# EAGLE design pendant_controller (EAGLE 9.2.2)
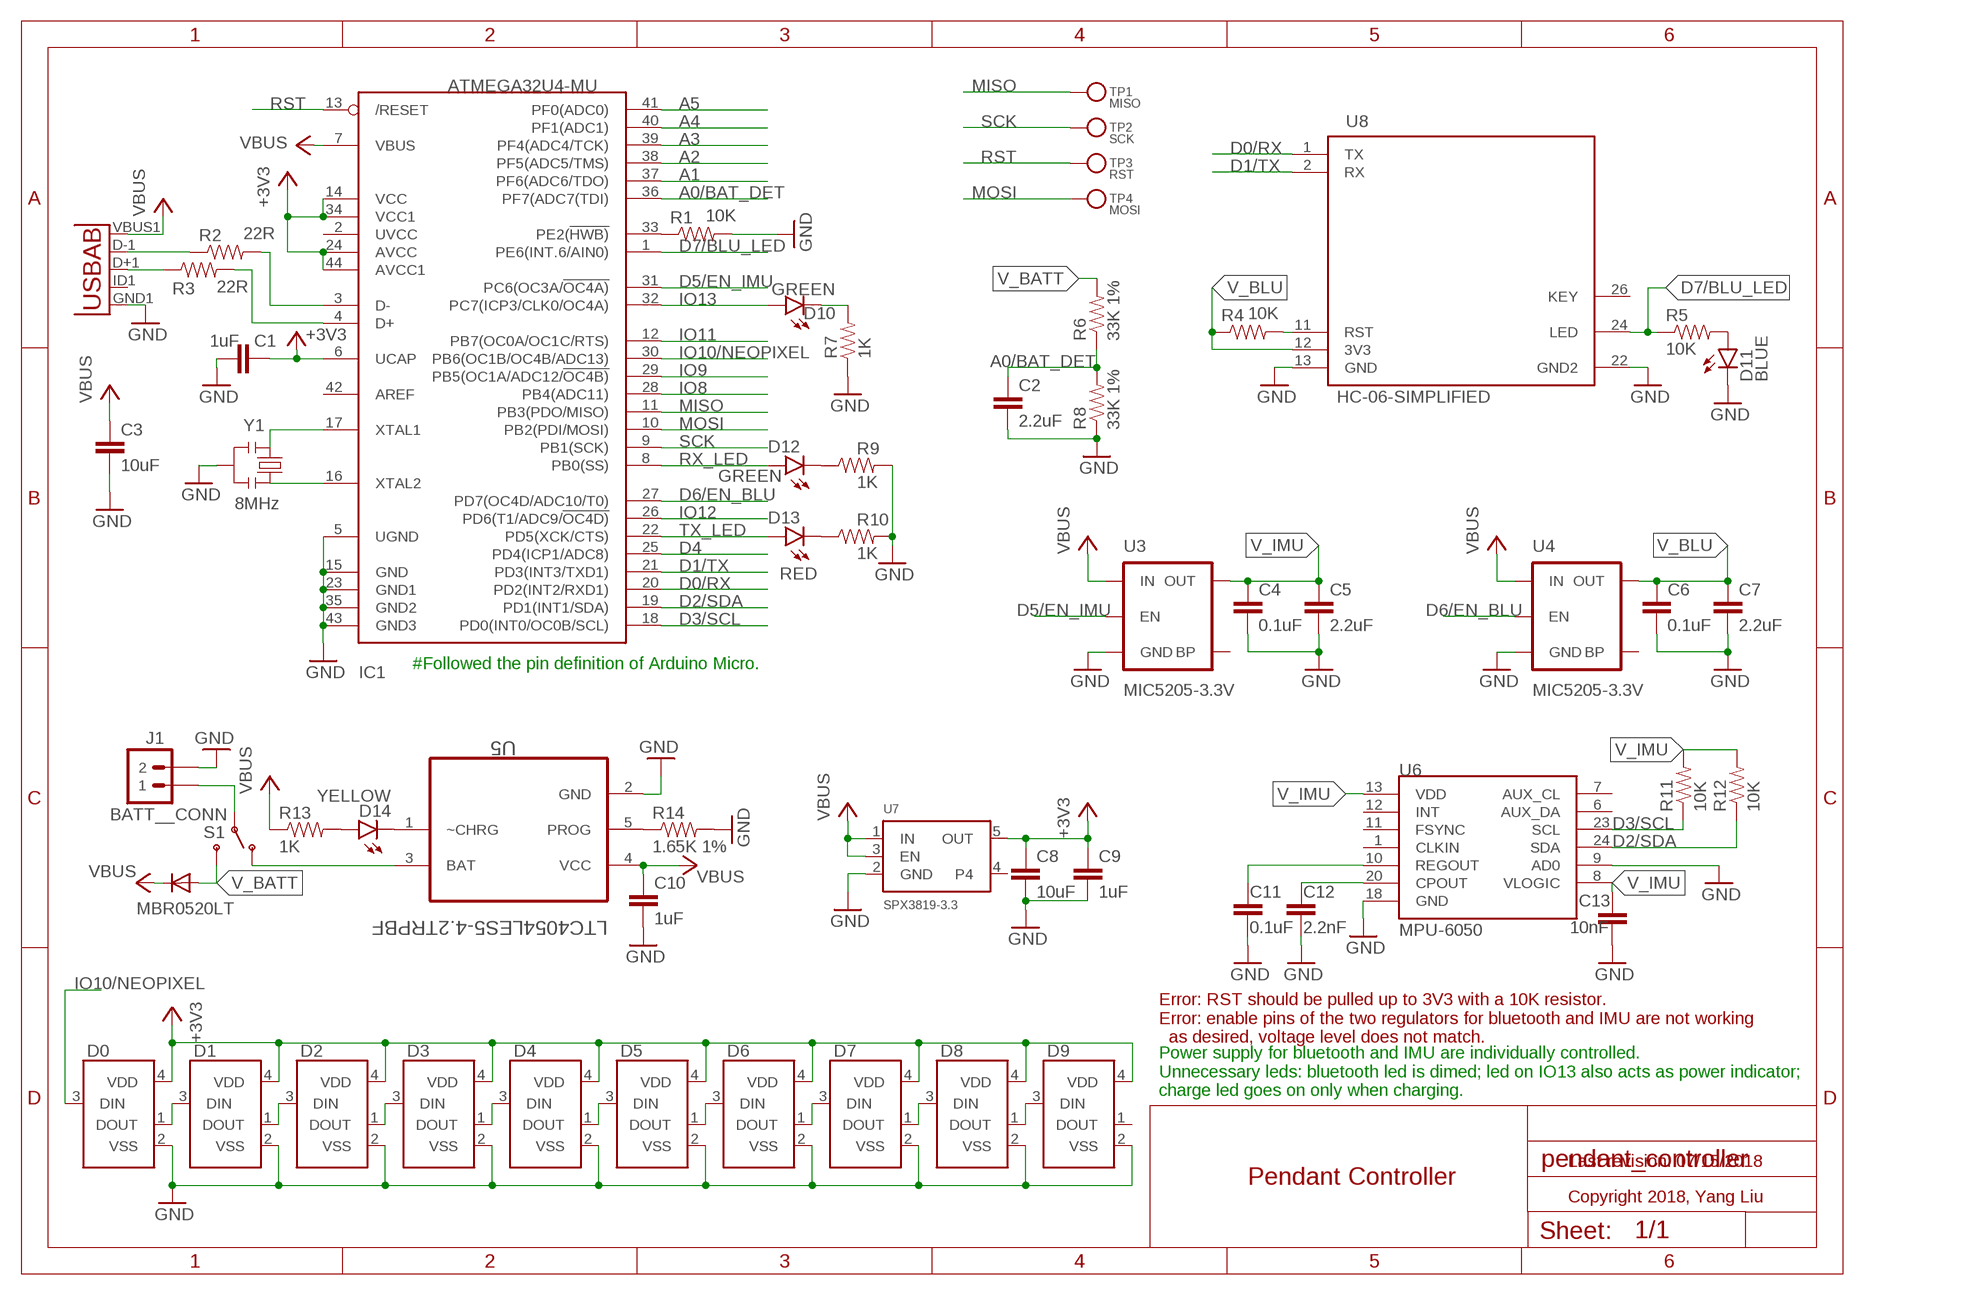
[diagram p0: schematic, sheet 1]

## Parts
C1  1uF  CAP0603-CAP  [0603-CAP]
C2  2.2uF  CAP0402-CAP  [0402-CAP]
C3  10uF  CAP1206  [1206]
C4  0.1uF  CAP0402-CAP  [0402-CAP]
C5  2.2uF  CAP0402-CAP  [0402-CAP]
C6  0.1uF  CAP0402-CAP  [0402-CAP]
C7  2.2uF  CAP0402-CAP  [0402-CAP]
C8  10uF  CAP1206  [1206]
C9  1uF  CAP0603-CAP  [0603-CAP]
C10  1uF  CAP0603-CAP  [0603-CAP]
C11  0.1uF  CAP0402-CAP  [0402-CAP]
C12  2.2nF  CAP0402-CAP  [0402-CAP]
C13  10nF  CAP0402-CAP  [0402-CAP]
D0  NEOPIXEL-2427  [LED2427]
D1  NEOPIXEL-2427  [LED2427]
D2  NEOPIXEL-2427  [LED2427]
D3  NEOPIXEL-2427  [LED2427]
D4  NEOPIXEL-2427  [LED2427]
D5  NEOPIXEL-2427  [LED2427]
D6  NEOPIXEL-2427  [LED2427]
D7  NEOPIXEL-2427  [LED2427]
D8  NEOPIXEL-2427  [LED2427]
D9  NEOPIXEL-2427  [LED2427]
D10  GREEN  LED0603  [LED-0603]
D11  BLUE  LED0603  [LED-0603]
D12  GREEN  LED0603  [LED-0603]
D13  RED  LED0603  [LED-0603]
D14  YELLOW  LED0603  [LED-0603]
D15  MBR0520LT  [SOD123]
IC1  ATMEGA32U4-MU  [TQFN44_7MM]
J1  BATT__CONN  M02-SMALL-PTH  [1X02-SMALL]
R1  10K  RESISTOR0402  [0402-RES]
R2  22R  RESISTOR0603  [0603-RES]
R3  22R  RESISTOR0603  [0603-RES]
R4  10K  RESISTOR0402  [0402-RES]
R5  10K  RESISTOR0402  [0402-RES]
R6  33K 1%  RESISTOR0402  [0402-RES]
R7  1K  RESISTOR0402  [0402-RES]
R8  33K 1%  RESISTOR0402  [0402-RES]
R9  1K  RESISTOR0402  [0402-RES]
R10  1K  RESISTOR0402  [0402-RES]
R11  10K  RESISTOR0402  [0402-RES]
R12  10K  RESISTOR0402  [0402-RES]
R13  1K  RESISTOR0402  [0402-RES]
R14  1.65K 1%  RESISTOR0402  [0402-RES]
S1  SWITCH-SPDTPTH  [SWITCH-SPDT]
TP1  MISO  TESTPOINTROUND1.5MM  [TESTPOINT_ROUND_1.5MM]
TP2  SCK  TESTPOINTROUND1.5MM  [TESTPOINT_ROUND_1.5MM]
TP3  RST  TESTPOINTROUND1.5MM  [TESTPOINT_ROUND_1.5MM]
TP4  MOSI  TESTPOINTROUND1.5MM  [TESTPOINT_ROUND_1.5MM]
U2  USB""  [USB-MICRO-SMD]
U3  MIC5205-3.3V  MIC52053.3V  [SOT23-5]
U4  MIC5205-3.3V  MIC52053.3V  [SOT23-5]
U5  LTC4054LES5-4.2TRPBF  [SOT95P280X100-5N]
U6  MPU-6050  [QFN-24]
U7  SPX3819-3.3  VREG_SOT23-5  [SOT23-5]
U8  HC-06-SIMPLIFIED  [HC-06_SMD]
Y1  8MHz  RESONATORSMD  [RESONATOR-SMD]

## Nets
+3V3: C1.1 C8.1 C9.1 D0.4(VDD) D1.4(VDD) D2.4(VDD) D3.4(VDD) D4.4(VDD) D5.4(VDD) D6.4(VDD) D7.4(VDD) D8.4(VDD) D9.4(VDD) IC1.6(UCAP) IC1.14(VCC) IC1.24(AVCC) IC1.34(VCC1) IC1.44(AVCC1) U7.5(OUT)
A0/BAT_DET: C2.1 IC1.36(PF7(ADC7(TDI)) R6.1 R8.2
A1: IC1.37(PF6(ADC6/TDO))
A2: IC1.38(PF5(ADC5/TMS))
A3: IC1.39(PF4(ADC4/TCK))
A4: IC1.40(PF1(ADC1))
A5: IC1.41(PF0(ADC0))
D0/RX: IC1.20(PD2(INT2/RXD1)) U8.1(TX)
D1/TX: IC1.21(PD3(INT3/TXD1)) U8.2(RX)
D2/SDA: IC1.19(PD1(INT1/SDA)) R12.1 U6.24(SDA)
D3/SCL: IC1.18(PD0(INT0/OC0B/SCL)) R11.1 U6.23(SCL)
D4: IC1.25(PD4(ICP1/ADC8))
D5/EN_IMU: IC1.31(PC6(OC3A/!OC4A)) U3.3(EN)
D6/EN_BLU: IC1.27(PD7(OC4D/ADC10/T0)) U4.3(EN)
D7/BLU_LED: IC1.1(PE6(INT.6/AIN0)) R5.1 U8.24(LED)
GND: C1.2 C2.2 C3.2 C4.2 C5.2 C6.2 C7.2 C8.2 C9.2 C10.2 C11.2 C12.2 C13.2 D0.2(VSS) D1.2(VSS) D2.2(VSS) D3.2(VSS) D4.2(VSS) D5.2(VSS) D6.2(VSS) D7.2(VSS) D8.2(VSS) D9.2(VSS) D11.C IC1.5(UGND) IC1.15(GND) IC1.23(GND1) IC1.35(GND2) IC1.43(GND3) J1.2 R1.2 R7.1 R8.1 R9.2 R10.2 R14.2 U2.GND1(GND) U3.2(GND) U4.2(GND) U5.2(GND) U6.9(AD0) U6.18(GND) U7.2(GND) U8.13(GND) U8.22(GND2) Y1.2
IO8: IC1.28(PB4(ADC11))
IO9: IC1.29(PB5(OC1A/ADC12/!OC4B))
IO10/NEOPIXEL: D0.3(DIN) IC1.30(PB6(OC1B/OC4B/ADC13))
IO11: IC1.12(PB7(OC0A/OC1C/RTS))
IO12: IC1.26(PD6(T1/ADC9/!OC4D))
IO13: D10.A IC1.32(PC7(ICP3/CLK0/OC4A))
MISO: IC1.11(PB3(PDO/MISO)) TP1.P$1
MOSI: IC1.10(PB2(PDI/MOSI)) TP4.P$1
N$1: S1.1(O) U5.3(BAT)
N$2: J1.1 S1.2(P)
N$3: R2.1 U2.D-1(D-)
N$4: D14.A R13.2
N$5: R3.1 U2.D+1(D+)
N$6: IC1.33(PE2(!HWB)) R1.1
N$7: IC1.4(D+) R3.2
N$8: R14.1 U5.5(PROG)
N$9: D14.C U5.1(~CHRG)
N$10: D0.1(DOUT) D1.3(DIN)
N$11: IC1.16(XTAL2) Y1.3
N$12: IC1.17(XTAL1) Y1.1
N$13: IC1.3(D-) R2.2
N$14: D12.C R9.1
N$15: D13.C R10.1
N$16: C12.1 U6.20(CPOUT)
N$17: C11.1 U6.10(REGOUT)
N$18: R4.2 U8.11(RST)
N$19: D10.C R7.2
N$20: D11.A R5.2
N$21: D1.1(DOUT) D2.3(DIN)
N$22: D2.1(DOUT) D3.3(DIN)
N$23: D3.1(DOUT) D4.3(DIN)
N$24: D4.1(DOUT) D5.3(DIN)
N$25: D5.1(DOUT) D6.3(DIN)
N$26: D6.1(DOUT) D7.3(DIN)
N$27: D7.1(DOUT) D8.3(DIN)
N$28: D8.1(DOUT) D9.3(DIN)
RST: IC1.13(/RESET) TP3.P$1
RX_LED: D12.A IC1.8(PB0(SS))
SCK: IC1.9(PB1(SCK)) TP2.P$1
TX_LED: D13.A IC1.22(PD5(XCK/CTS))
V_BATT: D15.A R6.2 S1.3(S)
V_BLU: C6.1 C7.1 R4.1 U4.5(OUT) U8.12(3V3)
V_IMU: C4.1 C5.1 C13.1 R11.2 R12.2 U3.5(OUT) U6.8(VLOGIC) U6.13(VDD)
VBUS: C3.1 C10.1 D15.C IC1.7(VBUS) R13.1 U2.VBUS1(VBUS) U3.1(IN) U4.1(IN) U5.4(VCC) U7.1(IN) U7.3(EN)
Unconnected: D9.1(DOUT) IC1.2(UVCC) IC1.42(AREF) U2.ID1(USBID) U3.4(BP) U4.4(BP) U6.1(CLKIN) U6.6(AUX_DA) U6.7(AUX_CL) U6.11(FSYNC) U6.12(INT) U7.4 U8.26(KEY)

## Notes on the sheet
- #Followed the pin definition of Arduino Micro.
- Error: RST should be pulled up to 3V3 with a 10K resistor.
  Error: enable pins of the two regulators for bluetooth and IMU are not working
    as desired, voltage level does not match.
- Power supply for bluetooth and IMU are individually controlled.
  Unnecessary leds: bluetooth led is dimed; led on IO13 also acts as power indicator;
  charge led goes on only when charging.
- Last revision: 07/15/2018
- Pendant Controller
- Copyright 2018, Yang Liu

## Library data of the parts
C1-C13 = SparkFun-Capacitors:CAP: Capacitor Standard 0603 ceramic capacitor, and 0.1" leaded capacitor.
D0 D1-D9 = yangliu_lib:NEOPIXEL-2427
D10-D14 = SparkFun-LED:LED: LEDs Standard schematic elements and footprints for 5mm, 3mm, 1206, and 0603 sized LEDs. 5mm - Spark Fun Electronics SKU : COM-00529 (and others)
D15 = diode:MBR0520LT: SCHOTTKY BARRIER RECTIFIER Source: http://onsemi.com .. MBR0520LT1-D.pdf
IC1 = microbuilder:ATMEGA32U4: http://www.ladyada.net/library/eagle
J1 = yangliu_lib:M02-SMALL-PTH
R1-R14 = SparkFun-Resistors:RESISTOR: Resistor Basic schematic elements and footprints for 0603, 1206, and PTH resistors.
S1 = yangliu_lib:SWITCH-SPDT: SPDT Switch Simple slide switch, Spark Fun Electronics SKU : COM-00102 DPDT SMT slide switch, AYZ0202, SWCH-08179; PROD_ID: SWCH-08261
TP1-TP4 = microbuilder:TESTPOINT: Test Point Various test points for characterisation and PCB testing TESTPOINT_SMT - Compact Surface Mount Test Point [Digikey: 5016KTR-ND]
U2 = MicroUSB:USB: This is a USB AB connector that is compatible with USB OTG. i.e. this connector can serve as a host or device
U3 U4 = SparkFun-PowerIC:MIC5205: MIC5205 150mA vreg 3.3V - VREG-00822 5V - VREG-00823; PROD_ID: VREG-00822
U5 = LTC_By_element14_Batch_1:LTC4054LES5-4.2TRPBF: Standalone Linear Li-Ion Battery Charger with Thermal Regulation; MPN: LTC4054LES5-4.2#TRPBF; OC_FARNELL: 1537421; OC_NEWARK: 58M0860; PACKAGE: SOT-23-5; SUPPLIER: Linear Technology
U6 = yangliu_lib:MPU-6050
U7 = microbuilder:VREG_SOT23-5: SOT23-5 Fixed Voltage Regulators Part Current Out V Out V In V Dropout θJA (°C/W) TJ (°C) Digikey Part No. ADP121 150mA 3.3V 3.4-5.5V 0.09V @ 150mA -- -- ADP121-AUJZ33R7CT-ND ADP121 150mA 3.0V 3.1-5.5V 0.09V @ 150mA -- -- ADP121-AUJZ30R7CT-ND ADP122 300mA 3.3V 3.4-5.5V 0.085V @ 300mA -- -- ADP122AUJZ-3.3-R7CT-ND ADP1712 300mA 3.3V 3.5-5.5V 0.17V @ 300mA -- -- ADP1712AUJZ-3.3-R7TR-ND AP7311 (Low Cost) 150mA 3.3V 3.5-6V 0.15V @ 150mA -- -- AP7311-33WG-7DICT-ND LD39015M18R 150mA 1.8V 1.9V-5.5V 0.08V @ 100mA -- -- 497-6977-1-ND LP2985A-33DBVR 150mA 3.3V 3.3-16V 0.28V @ 150mA 206 150 296-18479-1-ND MCP1824T-3302E/OT 300mA 3.3V 3.5V-6V 0.2V @ 300mA -- -- MCP1824T-3302E/OTCT-ND MIC5205-2.5YM5 TR 150mA 2.5V 2.7-16V 0.165V @ 150mA -- -- 576-1257-2-ND MIC5205-3.0YM5 TR 150mA 3.0V 3.2V-16V 0.165V @ 150mA -- -- 576-1258-2-ND MIC5205-3.3YM5 TR 150mA 3.3V 3.5V-16V 0.165V @ 150mA -- -- 576-1259-2-ND TPS780330220 150mA 3.3V+2.2V 3.6-5.5V 250mV Max -- -- 296-23332-1-ND TDA3663/N1,135 100mA 3.3V 3.5-45V 0.18V @ 50mA -- -- 568-5343-1-ND Max operating temp can be calculated using θJA, TJ (max junction temperature), and power in watts. Set the "Maximum Ambient Temperature" until it reaches TJ ("Max Junction Temperature"), which is the absolute limit for safe use of the regulator: Heat Sink Temperature Calculator <http://www.daycounter.com/Calculators/Heat-Sink-Temperature-Calculator.phtml> For example, With 12V source into a 3.3V LP2985 and a 30mA load, we are dissipating (12V-3.3V) * 0.03A = 0.261W. With a θJA of 206 °C/W, a TJ of 150°C, and 261mW we can safely use the chip without a heat sink up to 75°C (=147.1°C Junction Temperature).
U8 = yangliu_lib:HC-06-SIMPLIFIED
Y1 = SparkFun:RESONATOR: Resonator Small SMD resonator. This is the itty bitty 10/20MHz resonators with built in caps. CSTCE10M0G55 and CSTCE20M0V53. Footprint has been reviewed closely but hasn't been tested yet.

## Board
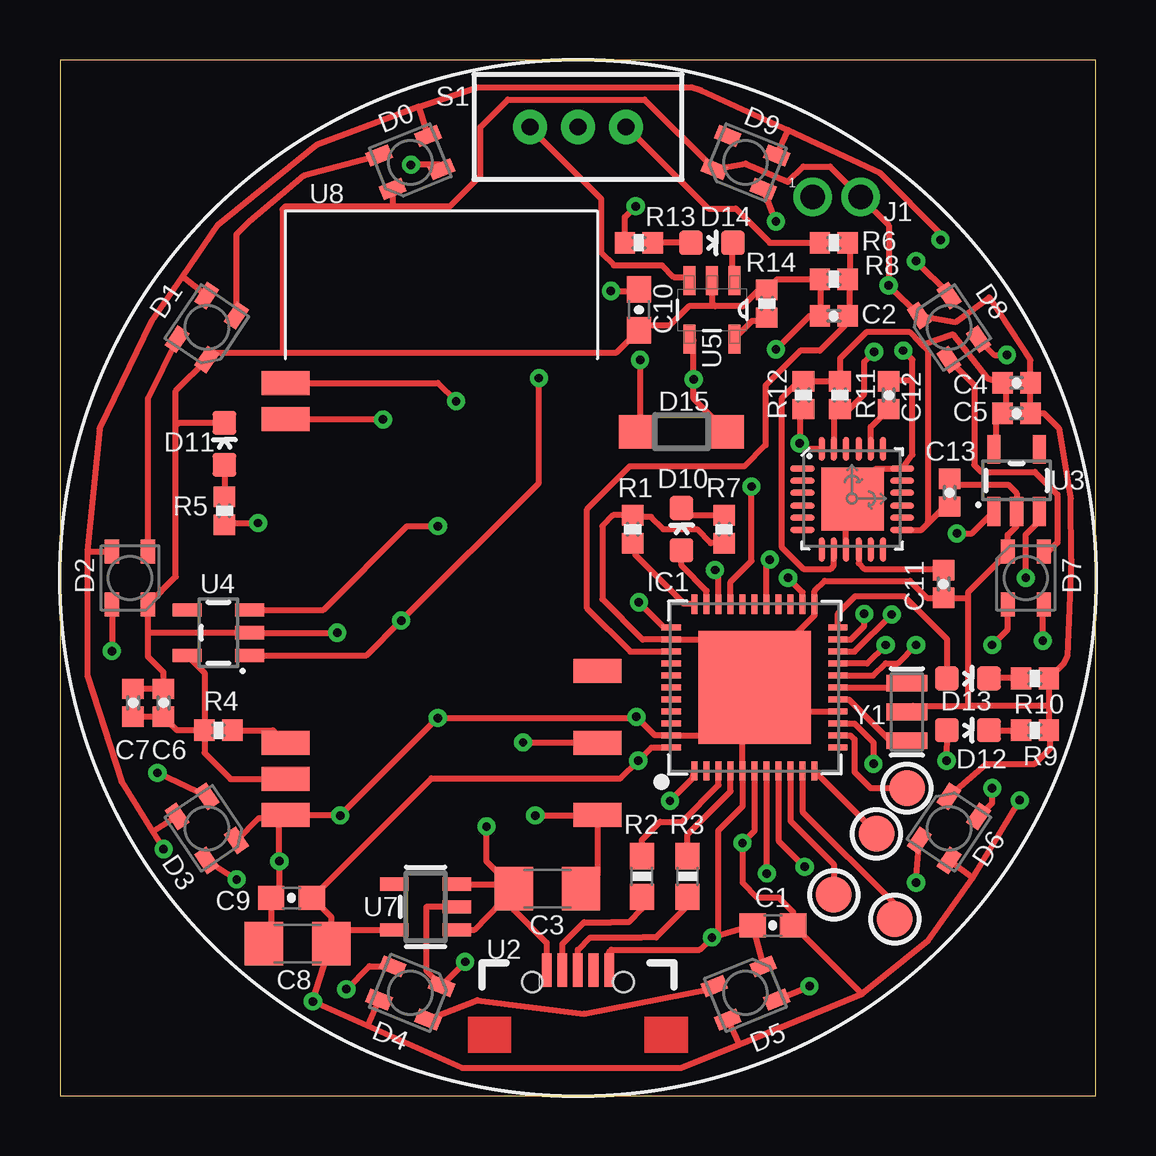
[diagram p1: board, top side]
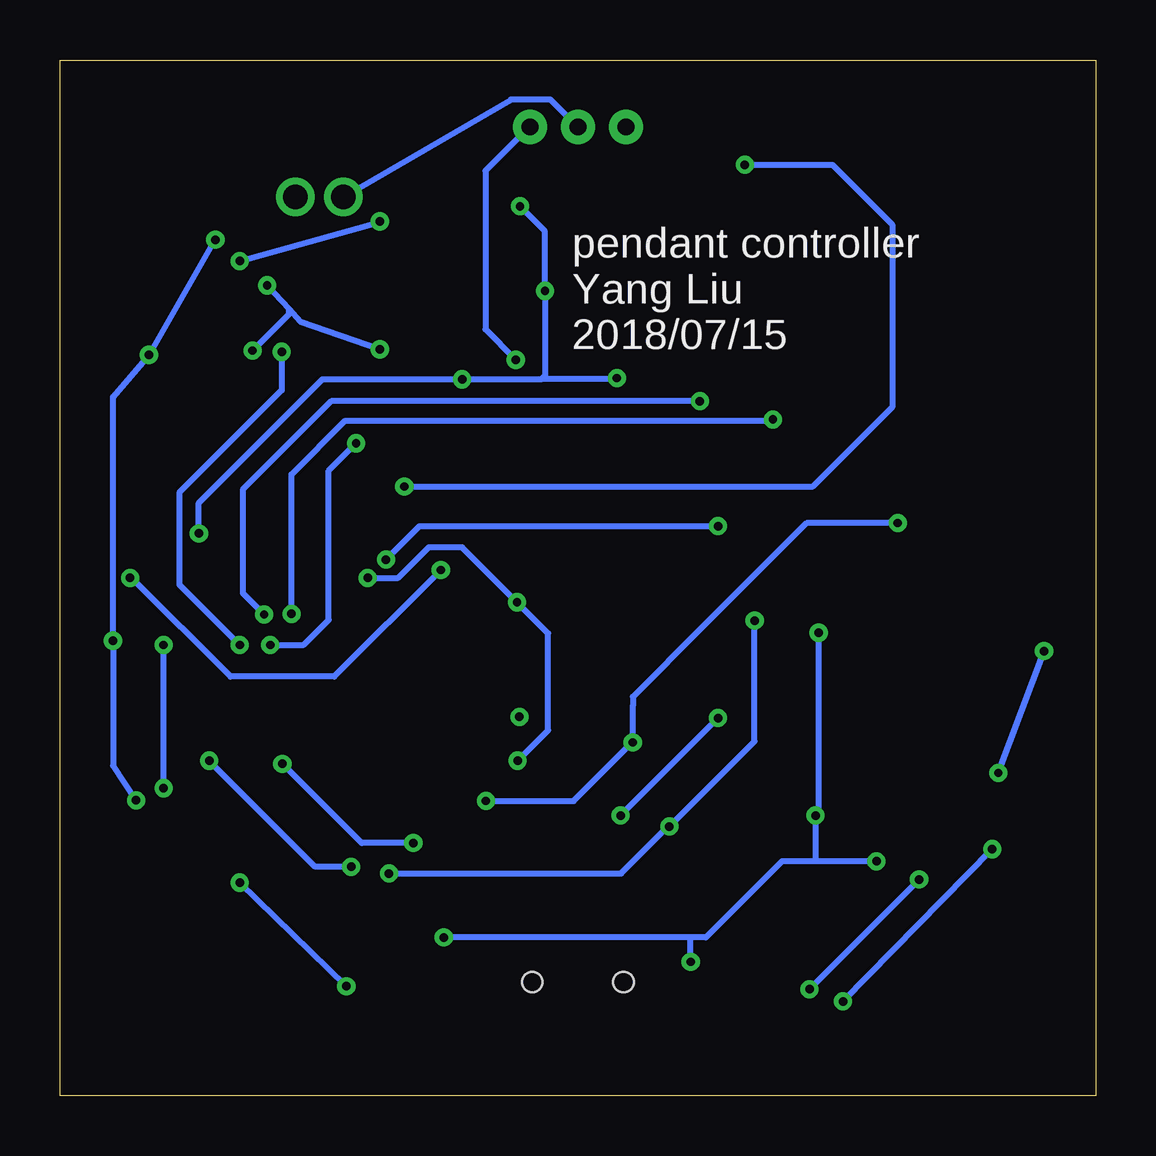
[diagram p2: board, bottom side, seen from below]

Size 43.18 x 43.18 mm. Coordinates in mm from the lower left corner, seen from the top.
Outline: 0,0 43.18,0 43.18,43.18 0.05,43.18 arc90 0,43.13 0,0
Copper layers (1*16): Top 0.035mm / dielectric 1.5mm / Bottom 0.035mm
Design rules "default *": minimum track width 10mil, minimum drill 0.35mm, track to track 6mil, track to pad 6mil, pad to pad 6mil, via to via 6mil, smd to smd 6mil, copper to edge 40mil, drill to drill 6mil, minimum pad ring 10mil, minimum via ring 8mil, stop-mask expansion 4mil, vias tented up to drill 0mil, thermal gap 10mil
tRestrict: area 0,0 to 43.2,43.2
bRestrict: area 0,0 to 43.2,43.2

### Footprints (pad centres in the part's own frame; a part is rotated, then mirrored left to right if it is on the bottom)
0603-CAP = smd 1.1 x 1: 1 -0.85,0; 2 0.85,0
0402-CAP = smd 0.85 x 0.9: 1 -0.58,0; 2 0.58,0
1206 = smd 1.6 x 1.8: 1 -1.4,0; 2 1.4,0
LED2427 = smd 1 x 0.6: 1 1.1,-0.75; 2 1.1,0.75; 3 -1.1,0.75; 4 -1.1,-0.75
LED-0603 = smd 1 x 1: A 0,-0.877; C 0,0.877
SOD123 = smd 1.4 x 1.4: A 1.9,0; C -1.9,0
TQFN44_7MM = smd 0.25 x 0.8: 1 -2.5,-3.475; 2 -2,-3.475; 3 -1.5,-3.475; 4 -1,-3.475; 5 -0.5,-3.475; 6 0,-3.475; 7 0.5,-3.475; 8 1,-3.475; 9 1.5,-3.475; 10 2,-3.475; 11 2.5,-3.475; 23 2.5,3.475; 24 2,3.475; 25 1.5,3.475; 26 1,3.475; 27 0.5,3.475; 28 0,3.475; 29 -0.5,3.475; 30 -1,3.475; 31 -1.5,3.475; 32 -2,3.475; 33 -2.5,3.475 | smd 0.8 x 0.25: 12 3.475,-2.5; 13 3.475,-2; 14 3.475,-1.5; 15 3.475,-1; 16 3.475,-0.5; 17 3.475,0; 18 3.475,0.5; 19 3.475,1; 20 3.475,1.5; 21 3.475,2; 22 3.475,2.5; 34 -3.475,2.5; 35 -3.475,2; 36 -3.475,1.5; 37 -3.475,1; 38 -3.475,0.5; 39 -3.475,0; 40 -3.475,-0.5; 41 -3.475,-1; 42 -3.475,-1.5; 43 -3.475,-2; 44 -3.475,-2.5 | smd 4.7 x 4.7: THERMAL 0,0
1X02-SMALL = drill 1.016 pad 1.6: 1 0,0; 2 2,0
0402-RES = smd 0.85 x 0.9: 1 -0.58,0; 2 0.58,0
0603-RES = smd 1.1 x 1: 1 -0.85,0; 2 0.85,0
SWITCH-SPDT = drill 0.7 pad 1.422: 1 -2,0; 2 0,0; 3 2,0
TESTPOINT_ROUND_1.5MM = smd 1.5 x 1.5: P$1 0,0
USB-MICRO-SMD = smd 1.4 x 0.4: D+1 2.7,0; D-1 2.7,0.65; GND1 2.7,-1.3; ID1 2.7,-0.65; VBUS1 2.7,1.3 | hole 0.85: 2.2,1.9; 2.2,-1.9
SOT23-5 = smd 0.55 x 1.2: 1 -0.95,-1.3; 2 0,-1.3; 3 0.95,-1.3; 4 0.95,1.3; 5 -0.95,1.3
SOT95P280X100-5N = smd 1.219 x 0.508: 1 -1.219,0.94; 2 -1.219,0; 3 -1.219,-0.94; 4 1.219,-0.94; 5 1.219,0.94
QFN-24 = smd 1.016 x 0.254: 1 -2.066,1.257; 2 -2.066,0.75; 3 -2.066,0.247; 4 -2.066,-0.287; 5 -2.066,-0.792; 6 -2.066,-1.297; 13 2.086,-1.297; 14 2.086,-0.792; 15 2.086,-0.287; 16 2.086,0.247; 17 2.086,0.75; 18 2.086,1.257 | smd 0.254 x 1.016: 7 -1.267,-2.122; 8 -0.762,-2.122; 9 -0.258,-2.122; 10 0.278,-2.122; 11 0.78,-2.122; 12 1.287,-2.122; 19 1.287,2.082; 20 0.78,2.082; 21 0.278,2.082; 22 -0.258,2.082; 23 -0.762,2.082; 24 -1.267,2.082 | smd 2.616 x 2.616: P$1 0.02,-0.01
HC-06_SMD = smd 2 x 1: 1 -6.35,3.81; 2 -6.35,2.31; 11 -6.35,-11.19; 12 -6.35,-12.69; 13 -6.35,-14.19; 22 6.65,-14.19; 24 6.65,-11.19; 26 6.65,-8.19
RESONATOR-SMD = smd 0.7 x 1.7: 1 -1.2,0; 2 0,0; 3 1.2,0

### Placement (x,y rotation side)
C1  29.72,7.11 180 top
C2  32.26,32.51 180 top
C3  20.32,8.64 0 top
C4  39.88,29.72 0 top
C5  39.88,28.45 0 top
C6  4.32,16.38 90 top
C7  3.05,16.38 90 top
C8  9.91,6.35 180 top
C9  9.65,8.26 180 top
C10  24.13,32.77 270 top
C11  36.83,21.34 270 top
C12  34.54,29.21 90 top
C13  37.08,25.15 90 top
D0  14.61,38.91 202 top
D1  6.12,32.03 236 top
D2  2.92,21.59 270 top
D3  6.12,11.15 304 top
D4  14.61,4.29 338 top
D5  28.57,4.29 22 top
D6  37.06,11.15 56 top
D7  40.26,21.59 90 top
D8  37.06,32.03 124 top
D9  28.57,38.91 158 top
D10  25.91,23.62 0 top
D11  6.86,27.18 0 top
D12  37.85,15.24 270 top
D13  37.85,17.4 270 top
D14  27.18,35.56 270 top
D15  25.91,27.69 180 top
IC1  28.96,17.02 0 top
J1  31.37,37.47 0 top
R1  23.88,23.62 90 top
R2  24.26,9.14 90 top
R3  26.16,9.14 90 top
R4  6.6,15.24 0 top
R5  6.86,24.38 90 top
R6  32.26,35.56 180 top
R7  27.69,23.62 90 top
R8  32.26,34.04 0 top
R9  40.64,15.24 0 top
R10  40.64,17.4 0 top
R11  32.51,29.21 90 top
R12  30.99,29.21 90 top
R13  24.13,35.56 0 top
R14  29.46,33.02 90 top
S1  21.59,40.39 0 top
TP1  34.04,10.92 0 top
TP2  32.26,8.38 0 top
TP3  35.31,12.83 0 top
TP4  34.8,7.37 0 top
U2  21.59,2.54 90 top
U3  39.88,25.65 0 top
U4  6.6,19.3 90 top
U5  27.18,32.77 270 top
U6  33.02,24.89 0 top
U7  15.24,7.87 90 top
U8  15.75,25.91 0 top
Y1  35.31,16 270 top

### Tracks (layer width: path | path; a pad name or v marks a point on that pad's centre or on a via)
+3V3  (via drill 0.35)
  Top 0.254: 6.1,33.33 D1.4 5.11,34.14 | 15.24,40.03 D0.4 | D9.4 29.87,39.22 30.35,40.26 | 15.44,40.03 D0.4 | 27.64,3.05 D5.4 28.33,2.14 | 38.41,31.5 D8.4 38.95,30.89 v39.47,30.89 | D0.4 14.96,41.23 | 14.96,41.23 10.67,39.62 6.6,36.32 5.11,34.14 | 33.43,4.25 C1.1 30.57,7.66 29.97,8.26 29.08,8.26 28.45,8.89 v28.45,10.54 28.96,11.05 IC1.6 | 12.83,2.92 v10.54,3.94 C8.1 | 12.83,2.92 16.77,1.17 25.88,1.17 28.33,2.14 | D4.4 12.83,2.92 | C8.1 11.31,7.45 C9.1 15.48,13.23 23.37,13.23 v24.11,13.97 24.65,14.52 IC1.44 | C8.1 11.88,6.92 U7.5 | IC1.14 33.12,15.52 33.91,14.73 v33.91,13.84 | 3.87,11.01 2.56,13.1 1.14,17.53 1.14,22.69 | 3.87,11.01 v4.32,10.29 | 1.14,22.69 D2.4 | 28.33,2.14 33.43,4.25 | v40.97,18.97 40.97,20.45 D7.4 | 5.11,34.14 3.81,32.26 1.65,27.81 1.14,22.69 | 30.35,40.26 34.19,38.45 36.7,35.94 v36.7,35.69 | D3.4 3.87,11.01 | 33.43,4.25 36.2,6.48 38.05,9.09 | D6.4 38.05,9.09 | 38.05,9.09 v40.01,12.32 | 30.35,40.26 26.75,41.9 26.29,42.04 17.4,42.04 14.96,41.23 | v24.13,20.57 25.19,19.52 IC1.34 | IC1.24 30.96,20.99 v30.35,21.59
  Bottom 0.254: v24.11,13.97 22.84,15.24 22.84,19.28 v24.13,20.57 26.42,22.86 27.81,22.86 29.08,21.59 v30.35,21.59 | v4.32,10.29 v10.54,3.94 | v28.45,10.54 30.61,10.54 v33.91,13.84 | v40.01,12.32 40.97,13.77 v40.97,18.97 40.97,29.13 v39.47,30.89 v36.7,35.69
A0/BAT_DET
  Top 0.254: R6.1 32.92,35.56 32.92,34.14 R8.2 32.92,33.93 32.92,32.51 C2.1 32.72,32.51 32.72,32.11 31.67,31.06 30.86,31.06 29.41,29.62 29.41,27.13 28.52,26.24 23.75,26.24 21.97,24.46 21.97,20.32 23.77,18.52 IC1.36
D0/RX  (via drill 0.35)
  Top 0.254: U8.1 15.75,29.72 v16.51,28.96 | IC1.20 33.12,18.52 v34.67,20.07
  Bottom 0.254: v16.51,28.96 31.88,28.96 35.56,25.27 35.56,20.95 v34.67,20.07
D1/TX  (via drill 0.35)
  Top 0.254: v13.46,28.19 9.42,28.19 U8.2 | IC1.21 32.96,19.02 33.53,19.58 v33.53,20.09
  Bottom 0.254: v13.46,28.19 13.51,28.14 31.29,28.14 33.53,25.91 v33.53,20.09
D2/SDA  (via drill 0.35)
  Top 0.254: v34.42,18.8 33.64,18.02 IC1.19 | R12.1 30.84,28.48 v30.84,27.2 31.07,26.97 U6.24
  Bottom 0.254: v34.42,18.8 33.02,18.8 31.98,19.84 31.98,26.06 v30.84,27.2
D3/SCL  (via drill 0.35)
  Top 0.254: v33.93,31.01 33.53,30.61 33.53,29.26 32.9,28.63 R11.1 32.26,28.38 U6.23 | IC1.18 33.9,17.52 34.42,18.03 34.92,18.03 v35.69,18.8
  Bottom 0.254: v33.93,31.01 33.93,29.41 38.2,25.15 38.2,21.31 v35.69,18.8
D5/EN_IMU  (via drill 0.35)
  Top 0.254: IC1.31 27.46,21.77 v27.3,21.92 | v40.26,21.59 40.26,23.39 40.83,23.96 U3.3
  Bottom 0.254: v27.3,21.92 31.75,17.48 36.07,17.48 40.18,21.59 v40.26,21.59
D6/EN_BLU  (via drill 0.35)
  Top 0.254: 7.92,20.32 U4.3 10.98,20.25 14.48,23.75 v15.75,23.75 | IC1.27 29.46,22.22 v29.59,22.35
  Bottom 0.254: v29.59,22.35 28.19,23.75 v15.75,23.75
D7/BLU_LED  (via drill 0.35)
  Top 0.254: v25.43,12.29 26.36,13.23 IC1.1 | 22.31,14.63 U8.24 22.38,14.73 v19.3,14.73 | R5.1 6.93,23.88 v8.26,23.88
  Bottom 0.254: v25.43,12.29 21.77,12.29 19.33,14.73 v19.3,14.73 19.3,16.26 19.3,16.64 16.38,19.56 12.19,23.75 | 12.19,23.75 12.06,23.88 | v8.26,23.88 12.06,23.88 | 12.06,23.88 12.19,23.75
GND  (via drill 0.35)
  Top 0.254: 27.58,22.96 R7.1 27.12,23.04 26.54,23.62 25.15,23.62 24.64,24.13 23.95,24.13 R1.2 23.06,24.2 22.61,23.75 22.61,20.7 24.29,19.02 IC1.35 26.96,19.02 28.7,17.27 | U8.13 9.35,11.58 8.28,11.58 D3.2 | 9.96,11.79 9.55,11.79 U8.13 | 16.46,7.72 U7.2 15.27,7.87 15.27,5.22 D4.2 16.89,5.56 v16.89,5.59 | 21.54,8.59 C3.2 | 21.74,8.59 C3.2 | 41.25,15.24 R9.2 41.25,15.27 | R10.2 41.25,17.25 41.25,16.26 | 35.26,16 Y1.2 35.56,16.26 37.85,16.26 | C13.2 37.29,25.48 39.52,25.48 39.88,25.12 U3.2 | U3.2 39.83,24.38 39.83,24.64 39.88,24.59 | 41.25,17.45 R10.2 | 31.7,33.73 31.7,33.93 R8.1 | 31.7,33.73 31.7,32.51 C2.2 31.24,32.51 v29.84,31.11 | 29.46,33.73 R14.2 | 31.7,33.73 R8.1 | R14.2 29.46,33.53 29.06,33.53 28.45,32.92 27.3,32.92 | 27.23,38.81 D9.2 | 14.02,37.8 D0.2 13.87,37.11 13.84,37.08 | 6.91,28.04 D11.C 4.94,28.05 4.83,27.94 | 26.64,15.02 IC1.43 25.4,15.04 24.79,15.04 v24.03,15.8 23.98,15.75 v15.75,15.75 | 26.64,15.02 26.67,14.99 | 26.64,15.02 28.45,15.02 | 28.45,15.02 29.75,15.02 30.35,15.62 | IC1.15 30.75,16.02 30.35,15.62 | 28.7,17.27 30.35,15.62 | 28.7,17.27 31.46,20.03 IC1.23 31.46,21.04 31.88,21.46 35.43,21.46 36.14,20.76 C11.2 37.79,20.76 37.85,20.7 | U6.9 32.77,24.89 34.02,26.15 U6.18 35.53,26.73 35.53,29.84 | 27.45,6.68 v27.18,6.6 26.67,6.1 22.99,6.1 22.89,6 U2.GND1 | 27.45,6.68 C1.2 D5.2 | 9.27,30.99 6.42,30.99 D1.2 4.83,29.4 4.83,27.94 | 9.27,30.99 23.2,30.99 C10.2 24.18,32.11 25.4,32.11 26.21,32.92 27.3,32.92 | 9.27,30.99 9.27,36.96 9.4,37.08 13.84,37.08 | 4.83,27.94 4.83,21.64 D2.2 3.67,19.3 | C8.2 8.8,6.65 C9.2 9.14,8.6 v9.14,9.78 9.14,11.46 U8.13 | C3.2 21.72,8.51 22.4,9.19 U8.22 22.36,11.68 v19.81,11.68
  Top 0.254: 15.72,15.77 v15.75,15.75 | 27.45,6.68 27.43,6.7 27.43,11.05 28.46,12.07 IC1.5 28.46,15.01 28.45,15.02 | C7.2 C6.2 4.32,17.65 3.67,18.3 3.67,19.3 | U5.2 27.18,33.05 27.3,32.92 | U3.2 39.88,23.75 39.51,23.38 D7.2 39.51,22.64 37.85,20.98 37.85,20.7 | v35.15,31.06 35.53,30.68 35.53,29.84 | C12.2 34.6,29.84 35.53,29.84 | R14.2 29.9,34.04 R8.1 | 3.67,19.3 U4.2 v11.56,19.3 | R10.2 41.86,18.04 41.98,18.31 42.16,22.35 42.13,24.86 41.63,27.84 41.02,28.45 C5.2 C4.2 40.46,30.66 38.73,33.27 37.34,32.26 D8.2 34.56,33.78 v34.54,33.78 34.54,36.29 J1.2 32.1,38.73 30.99,38.73 30.35,38.1 28.57,38.86 D9.2 | 41.25,15.27 41.25,16.26 | 41.25,16.26 37.85,16.26 | 37.85,20.7 37.85,16.26 | 13.84,37.08 16.26,37.08 17.53,38.35 17.53,40.39 18.67,41.53 24.38,41.53 D9.2 | v15.75,15.75 v11.68,11.68 9.43,11.68 U8.13 | D6.2 38.61,13.84 40.64,13.84 41.27,14.48 41.27,15.24 41.25,15.27
  Bottom 0.254: v15.75,15.75 v19.81,11.68 | v9.14,9.78 11.68,9.78 | 11.68,9.78 13.08,9.78 16.26,6.6 16.89,6.6 | 16.89,6.6 v27.18,6.6 | v16.89,5.59 16.89,6.6 | v29.84,31.11 33.15,32.26 33.63,32.79 | 33.63,32.79 v34.54,33.78 | v35.15,31.06 33.63,32.59 33.63,32.79 | v11.56,19.3 11.56,11.81 v11.68,11.68 11.68,9.78
IO10/NEOPIXEL  (via drill 0.35)
  Top 0.254: v14.63,38.81 15.85,38.81 D0.3 | IC1.30 27.96,21.43 28.83,22.3 v28.83,25.4
  Bottom 0.254: v14.63,38.81 10.97,38.81 8.48,36.32 8.48,28.7 11.79,25.4 v28.83,25.4
IO13
  Top 0.254: IC1.32 26.96,21.05 25.91,22.1 D10.A
MISO
  Top 0.254: 31.5,13.41 IC1.11 34.04,10.96 TP1.P$1
MOSI
  Top 0.254: TP4.P$1 34.8,8 30.96,11.84 IC1.10
N$1
  Top 0.254: U5.3 26.21,34.14 25.58,34.14 25.09,34.62 23.09,34.62 22.55,35.15 22.55,37.39 19.71,40.23 S1.1
N$2
  Bottom 0.254: S1.2 22.73,41.53 24.38,41.53 J1.1
N$3
  Top 0.254: U2.D-1 20.94,6.33 21.84,7.24 22.99,7.24 23.71,7.24 24.26,7.79 R2.1
N$4
  Top 0.254: R13.2 24.79,35.56 26.21,35.56 D14.A
N$5
  Top 0.254: R3.1 26.16,7.91 24.85,6.6 24.26,6.6 22.1,6.6 21.59,6.1 U2.D+1
N$6
  Top 0.254: IC1.33 26.42,20.52 26.01,20.52 23.98,22.55 23.98,22.96 R1.1
N$7
  Top 0.254: IC1.4 27.96,12.7 26.16,10.91 R3.2
N$8
  Top 0.254: R14.1 29.46,32.31 28.85,32.31 28.25,31.7 U5.5
N$9
  Top 0.254: D14.C 28.04,34.14 U5.1
N$10
  Top 0.254: D0.1 10.16,38.35 7.88,36.44 7.36,35.92 D1.3
N$11
  Top 0.254: IC1.16 32.89,16.52 34.63,14.78 35.26,14.78 Y1.3 34.98,14.8
N$12
  Top 0.254: 34.8,17.2 Y1.1 35.12,17.02 IC1.17
N$13
  Top 0.254: IC1.3 27.46,12.95 25.93,11.43 25.02,11.43 24.26,10.67 R2.2
N$14
  Top 0.254: R9.1 40.03,15.24 38.81,15.24 D12.C
N$15
  Top 0.254: R10.1 40.03,17.45 38.77,17.45 D13.C 38.81,17.45
N$16
  Top 0.254: 34.39,28.45 C12.1 33.8,27.89 U6.20
N$17
  Top 0.254: U6.10 33.3,22.2 33.53,21.97 36.77,21.97 C11.1
N$18
  Top 0.254: 9.35,14.83 U8.11 8.88,15.24 R4.2
N$19
  Top 0.254: 26.01,24.38 D10.C 26.2,24.2 R7.2
N$20
  Top 0.254: D11.A R5.2
N$21
  Top 0.254: D2.3 3.67,29.08 D1.1
N$22  (via drill 0.35)
  Top 0.254: 6.1,12.6 D3.3 v4.06,13.46 | D2.1 2.17,18.55 v2.16,18.54
  Bottom 0.254: v4.06,13.46 v2.16,18.54
N$23  (via drill 0.35)
  Top 0.254: v11.94,4.45 12.89,5.4 D4.3 | D3.1 v7.37,9.02
  Bottom 0.254: v7.37,9.02 v11.94,4.45
N$24
  Top 0.254: D4.1 17.39,3.98 21.84,3.43 27.15,4.45 D5.3
N$25  (via drill 0.35)
  Top 0.254: D5.1 v31.24,4.57 | v35.69,8.89 D6.3
  Bottom 0.254: v35.69,8.89 v31.24,4.58 v31.24,4.57
N$26  (via drill 0.35)
  Top 0.254: D6.1 38.86,12.21 v38.86,12.83 | v38.86,18.8 39.51,19.44 D7.3
  Bottom 0.254: v38.86,12.83 v38.86,18.8
N$27
  Top 0.254: D8.3 38.11,29.64 38.11,26.3 38.41,26.01 40.64,26.01 41.58,25.07 41.58,23.06 41.21,22.69 D7.1
N$28  (via drill 0.35)
  Top 0.254: D8.1 37.06,33.42 v35.69,34.8 | v29.84,36.45 D9.3
  Bottom 0.254: v35.69,34.8 29.87,36.43 v29.84,36.45
RST
  Top 0.254: TP3.P$1 33.78,12.83 33.12,13.49 33.12,14.86 32.96,15.02 IC1.13
RX_LED  (via drill 0.35)
  Top 0.254: 36.98,15.24 D12.A v36.96,13.97 | IC1.8 29.96,10.63 v31.04,9.55
  Bottom 0.254: v31.04,9.55 32.54,9.55 v36.96,13.97
SCK
  Top 0.254: IC1.9 30.46,11.45 32.26,9.65 TP2.P$1
TX_LED
  Top 0.254: D13.A 36.97,19.04 35.18,20.83 33.91,20.83 33.15,20.83 32.43,20.11 IC1.22
V_BATT  (via drill 0.35)
  Top 0.254: R6.2 31.5,35.56 29.59,35.56 28.17,36.98 27.03,36.98 23.77,40.23 S1.3 | v24.18,30.68 24.18,27.84 D15.A
  Bottom 0.254: S1.3 23.77,40.23 25.45,38.56 25.45,31.95 v24.18,30.68
V_BLU
  Top 0.254: U8.12 9.39,13.21 7.11,13.21 6.02,14.3 R4.1 | 5.84,15.42 R4.1 | U4.5 6.02,17.63 R4.1 | R4.1 4.88,15.24 C6.1 C7.1
V_IMU
  Top 0.254: 31.09,29.87 R12.2 | R12.2 30.89,29.87 30.07,29.06 30.07,22.89 30.99,21.97 32.13,21.97 32.26,22.1 U6.8 | 36.98,24.38 C13.1 36.88,24.57 36.2,23.88 | U3.5 39.01,27.03 39.01,28.25 39.22,28.45 C5.1 39.42,28.45 39.42,29.67 C4.1 38.65,29.92 37.21,31.75 35.95,31.31 35.85,31.41 | 35.85,31.41 35.92,31.34 36.17,31.09 36.17,23.9 36.2,23.88 | U6.13 35.91,23.59 36.2,23.88 | R12.2 R11.2 32.51,30.73 33.6,31.83 35.43,31.83 35.85,31.41
VBUS  (via drill 0.35)
  Top 0.254: 18.7,8.13 C3.1 | 16.66,8.74 U7.3 18.73,8.82 C3.1 | C3.1 17.28,6.92 U7.1 | U5.4 26.42,31.5 v26.42,29.87 26.42,29.06 27.64,27.84 D15.C | U4.1 7.91,18.36 12.78,18.36 v14.22,19.81 19.96,25.55 v19.96,29.92 | C3.1 18.92,7.75 20.29,6.38 U2.VBUS1 | IC1.7 v29.46,9.28 v29.46,9.27 | 18.92,8.69 C3.1 | C3.1 17.78,9.78 v17.78,11.23 | v37.39,23.44 38.02,23.44 U3.1 | v22.96,33.55 24.07,33.55 C10.1 | R13.1 23.55,36.63 v24,37.08
  Bottom 0.254: v19.96,29.92 19.96,29.87 23.11,29.87 | 23.11,29.87 v26.42,29.87 32.23,29.87 37.39,24.71 v37.39,23.44 | 23.11,29.87 22.96,30.02 v22.96,33.55 22.96,36.04 23.24,36.32 v24,37.08 | v29.46,9.27 19.79,9.27 17.83,11.23 v17.78,11.23 14.22,14.78 v14.22,19.81

### Text on the board
bPlace: pendant controller / Yang Liu / 2018/07/15